# Altium schematic sheet POSEDGE_Wing_8_template.SchDoc: POSEDGE 8-bit Wing Template
size A4; Organization: www.posedge.ir
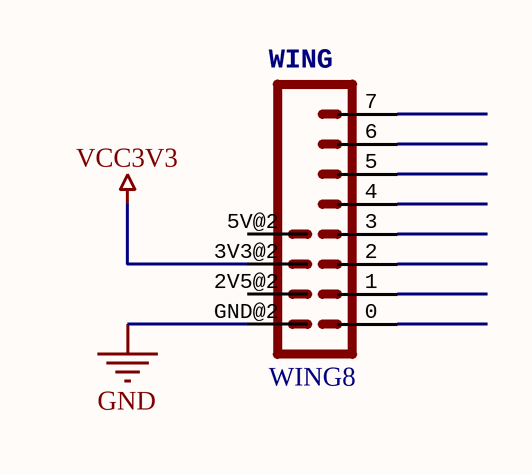
[diagram p0: POSEDGE_Wing_8_template.SchDoc]

## Parts
WING  WING8  [WINGSIDE_8BIT]

## Nets
GND: WING.GND@2(GND)
VCC3V3: WING.3V3@2(3V3)

Not connected (* = marked no-connect by the designer): WING 0(1) 1(2) 2(3) 2V5@2(2V5) 3(4) 4(5) 5(6) 5V@2(5V) 6(7) 7(8)

## Notes on the sheet
- Title
- Size:
- Date:
- A4
- Number:
- Revision:
- Sheet
- of